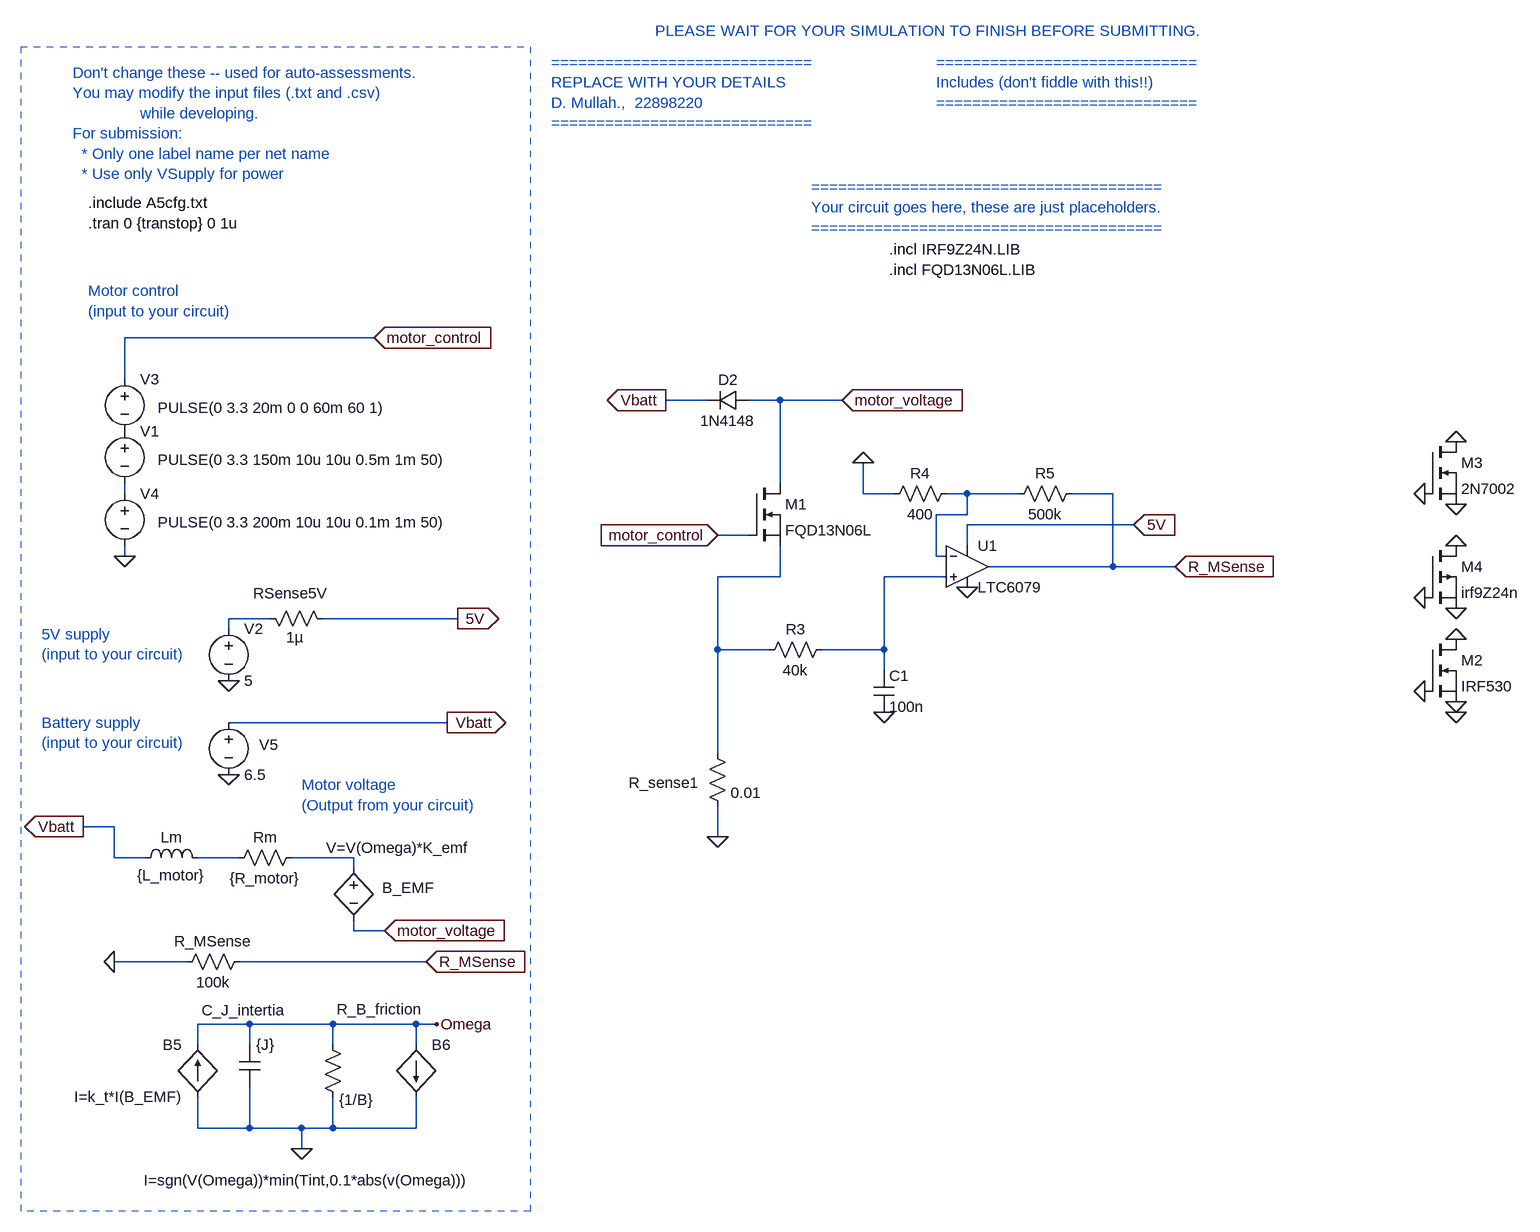
[diagram p0: schematic E344_22898220_A5.asc]
E344_22898220_A5.asc, the LTspice schematic file:
Version 4
SHEET 1 1824 2192
WIRE -1824 -976 -2208 -976
WIRE -2208 -912 -2208 -976
WIRE -1312 -880 -1376 -880
WIRE -1200 -880 -1248 -880
WIRE -1104 -880 -1200 -880
WIRE -1200 -752 -1200 -880
WIRE -2208 -736 -2208 -752
WIRE -1072 -736 -1072 -784
WIRE -1024 -736 -1072 -736
WIRE -912 -736 -944 -736
WIRE -832 -736 -912 -736
WIRE -688 -736 -752 -736
WIRE -912 -704 -912 -736
WIRE -912 -704 -960 -704
WIRE -656 -688 -912 -688
WIRE -1248 -672 -1296 -672
WIRE -912 -656 -912 -688
WIRE -2208 -640 -2208 -656
WIRE -960 -640 -960 -704
WIRE -944 -640 -960 -640
WIRE -688 -624 -688 -736
WIRE -688 -624 -880 -624
WIRE -592 -624 -688 -624
WIRE -1200 -608 -1200 -656
WIRE -1200 -608 -1296 -608
WIRE -944 -608 -1040 -608
WIRE -1984 -544 -2048 -544
WIRE -1696 -544 -1904 -544
WIRE -2048 -528 -2048 -544
WIRE -1296 -496 -1296 -608
WIRE -1216 -496 -1296 -496
WIRE -1040 -496 -1040 -608
WIRE -1040 -496 -1136 -496
WIRE -1040 -464 -1040 -496
WIRE -1712 -384 -2048 -384
WIRE -1296 -336 -1296 -496
WIRE -2224 -224 -2272 -224
WIRE -1296 -208 -1296 -256
WIRE -2224 -176 -2224 -224
WIRE -2176 -176 -2224 -176
WIRE -2032 -176 -2096 -176
WIRE -1856 -176 -1952 -176
WIRE -1856 -160 -1856 -176
WIRE -1856 -64 -1856 -80
WIRE -1808 -64 -1856 -64
WIRE -2112 -16 -2224 -16
WIRE -1744 -16 -2032 -16
WIRE -2016 80 -2096 80
WIRE -1888 80 -2016 80
WIRE -1760 80 -1888 80
WIRE -1728 80 -1760 80
WIRE -2096 112 -2096 80
WIRE -2016 112 -2016 80
WIRE -1888 112 -1888 80
WIRE -1760 112 -1760 80
WIRE -2096 240 -2096 192
WIRE -2016 240 -2016 176
WIRE -2016 240 -2096 240
WIRE -1936 240 -2016 240
WIRE -1888 240 -1888 192
WIRE -1888 240 -1936 240
WIRE -1760 240 -1760 192
WIRE -1760 240 -1888 240
WIRE -1936 272 -1936 240
FLAG -1696 -544 5V
IOPIN -1696 -544 Out
FLAG -2048 -448 0
FLAG -2208 -640 0
FLAG -1824 -976 motor_control
IOPIN -1824 -976 In
FLAG -1296 -672 motor_control
IOPIN -1296 -672 In
FLAG -1104 -880 motor_voltage
IOPIN -1104 -880 In
FLAG -2048 -304 0
FLAG -1712 -384 Vbatt
IOPIN -1712 -384 Out
FLAG -1808 -64 motor_voltage
IOPIN -1808 -64 In
FLAG -2272 -224 Vbatt
IOPIN -2272 -224 Out
FLAG -1728 80 Omega
FLAG -1936 272 0
FLAG -1376 -880 Vbatt
IOPIN -1376 -880 Out
FLAG -1744 -16 R_MSense
IOPIN -1744 -16 In
FLAG -2224 -16 0
FLAG -592 -624 R_MSense
IOPIN -592 -624 In
FLAG -656 -688 5V
IOPIN -656 -688 In
FLAG -160 -400 0
FLAG -208 -432 0
FLAG -160 -512 0
FLAG -160 -416 0
FLAG -160 -720 0
FLAG -208 -736 0
FLAG -160 -816 0
FLAG -208 -576 0
FLAG -160 -560 0
FLAG -160 -656 0
FLAG -1296 -208 0
FLAG -1072 -784 0
FLAG -912 -592 0
FLAG -1040 -400 0
SYMBOL voltage -2048 -544 R0
WINDOW 123 0 0 Left 0
WINDOW 39 0 0 Left 0
SYMATTR InstName V2
SYMATTR Value 5
SYMBOL res -2000 -560 M90
WINDOW 0 -7 47 VBottom 2
WINDOW 3 29 54 VTop 2
SYMATTR InstName RSense5V
SYMATTR Value 1µ
SYMBOL diode -1248 -896 R90
WINDOW 0 0 32 VBottom 2
WINDOW 3 32 32 VTop 2
SYMATTR InstName D2
SYMATTR Value 1N4148
SYMBOL voltage -2208 -928 R0
WINDOW 123 0 0 Left 0
WINDOW 39 0 0 Left 0
WINDOW 3 51 60 Left 2
SYMATTR Value PULSE(0 3.3 20m 0 0 60m 60 1)
SYMATTR InstName V3
SYMBOL voltage -2048 -400 R0
WINDOW 123 0 0 Left 0
WINDOW 39 0 0 Left 0
WINDOW 0 47 50 Left 2
SYMATTR InstName V5
SYMATTR Value 6.5
SYMBOL res -2048 -160 R270
WINDOW 3 0 56 VBottom 2
WINDOW 0 32 56 VTop 2
SYMATTR Value {R_motor}
SYMATTR InstName Rm
SYMBOL ind -2192 -160 R270
WINDOW 0 32 56 VTop 2
WINDOW 3 5 56 VBottom 2
SYMATTR InstName Lm
SYMATTR Value {L_motor}
SYMBOL bv -1856 -176 R0
WINDOW 3 -42 -15 Left 2
WINDOW 0 44 46 Left 2
SYMATTR Value V=V(Omega)*K_emf
SYMATTR InstName B_EMF
SYMBOL bi -2096 192 R180
WINDOW 0 24 80 Left 2
WINDOW 3 24 0 Left 2
SYMATTR InstName B5
SYMATTR Value I=k_t*I(B_EMF)
SYMBOL bi -1760 112 R0
WINDOW 3 -419 208 Left 2
SYMATTR Value I=sgn(V(Omega))*min(Tint,0.1*abs(v(Omega)))
SYMATTR InstName B6
SYMBOL cap -2032 112 R0
WINDOW 0 -58 -53 Left 2
WINDOW 3 26 0 Left 2
SYMATTR InstName C_J_intertia
SYMATTR Value {J}
SYMBOL res -1904 96 R0
WINDOW 0 22 -39 Left 2
WINDOW 3 26 100 Left 2
SYMATTR InstName R_B_friction
SYMATTR Value {1/B}
SYMBOL voltage -2208 -848 R0
WINDOW 123 0 0 Left 0
WINDOW 39 0 0 Left 0
WINDOW 3 51 60 Left 2
SYMATTR Value PULSE(0 3.3 150m 10u 10u 0.5m 1m 50)
SYMATTR InstName V1
SYMBOL voltage -2208 -752 R0
WINDOW 123 0 0 Left 0
WINDOW 39 0 0 Left 0
WINDOW 3 51 60 Left 2
SYMATTR Value PULSE(0 3.3 200m 10u 10u 0.1m 1m 50)
SYMATTR InstName V4
SYMBOL res -2016 -32 R90
WINDOW 0 0 56 VBottom 2
WINDOW 3 32 56 VTop 2
SYMATTR InstName R_MSense
SYMATTR Value 100k
SYMBOL Opamps\\LTC6079 -912 -624 R0
SYMATTR InstName U1
SYMBOL nmos -208 -512 R0
SYMATTR InstName M2
SYMATTR Value IRF530
SYMBOL nmos -208 -816 R0
SYMATTR InstName M3
SYMATTR Value 2N7002
SYMBOL pmos -208 -656 R0
SYMATTR InstName M4
SYMATTR Value irf9Z24n
SYMBOL nmos -1248 -752 R0
SYMATTR InstName M1
SYMATTR Value FQD13N06L
SYMBOL res -1120 -512 R90
WINDOW 0 0 56 VBottom 2
WINDOW 3 32 56 VTop 2
SYMATTR InstName R3
SYMATTR Value 40k
SYMBOL res -1312 -352 R0
WINDOW 0 -121 61 Left 2
SYMATTR InstName R_sense1
SYMATTR Value 0.01
SYMBOL res -928 -752 R90
WINDOW 0 0 56 VBottom 2
WINDOW 3 32 56 VTop 2
SYMATTR InstName R4
SYMATTR Value 400
SYMBOL res -736 -752 R90
WINDOW 0 0 56 VBottom 2
WINDOW 3 32 56 VTop 2
SYMATTR InstName R5
SYMATTR Value 500k
SYMBOL cap -1056 -464 R0
SYMATTR InstName C1
SYMATTR Value 100n
TEXT -2288 -1384 Left 2 ;Don't change these -- used for auto-assessments.\nYou may modify the input files (.txt and .csv) \n               while developing.\nFor submission: \n  * Only one label name per net name\n  * Use only VSupply for power
TEXT -1552 -1400 Left 2 ;=============================\nREPLACE WITH YOUR DETAILS\nD. Mullah.,  22898220\n=============================
TEXT -960 -1400 Left 2 ;=============================\nIncludes (don't fiddle with this!!)\n=============================
TEXT -1152 -1208 Left 2 ;=======================================\nYour circuit goes here, these are just placeholders.\n=======================================
TEXT -1392 -1448 Left 2 ;PLEASE WAIT FOR YOUR SIMULATION TO FINISH BEFORE SUBMITTING.
TEXT -2264 -1152 Left 2 !.tran 0 {transtop} 0 1u
TEXT -2264 -1184 Left 2 !.include A5cfg.txt
TEXT -2264 -1048 Left 2 ;Motor control\n(input to your circuit)
TEXT -2336 -520 Left 2 ;5V supply \n(input to your circuit)
TEXT -2336 -384 Left 2 ;Battery supply \n(input to your circuit)
TEXT -1936 -288 Left 2 ;Motor voltage\n(Output from your circuit)
TEXT -1032 -1112 Left 2 !.incl IRF9Z24N.LIB\n.incl FQD13N06L.LIB
LINE Normal -1584 -1424 -1584 368 2
LINE Normal -2368 -1424 -1584 -1424 2
LINE Normal -1584 368 -2368 368 2
LINE Normal -2368 -1424 -2368 368 2

The netlist it stands for:
* E344_22898220_A5.asc
V2 N005 0 5
RSense5V N005 5V 1µ
D2 motor_voltage Vbatt 1N4148
V3 motor_control P001 PULSE(0 3.3 20m 0 0 60m 60 1)
V5 Vbatt 0 6.5
Rm N006 N007 {R_motor}
Lm Vbatt N006 {L_motor}
B_EMF N007 motor_voltage V=V(Omega)*K_emf
B5 0 Omega I=k_t*I(B_EMF)
B6 Omega 0 I=sgn(V(Omega))*min(Tint,0.1*abs(v(Omega)))
C_J_intertia Omega 0 {J}
R_B_friction Omega 0 {1/B}
V1 P001 N001 PULSE(0 3.3 150m 10u 10u 0.5m 1m 50)
V4 N001 0 PULSE(0 3.3 200m 10u 10u 0.1m 1m 50)
R_MSense R_MSense 0 100k
XU1 N004 N002 5V 0 R_MSense LTC6078  ; LTC6079, pins In+ In- V+ V- OUT
M2 0 0 0 0 IRF530
M3 0 0 0 0 2N7002
M4 0 0 0 0 irf9Z24n
M1 motor_voltage motor_control N003 N003 FQD13N06L
R3 N004 N003 40k
R_sense1 N003 0 0.01
R4 N002 0 400
R5 R_MSense N002 500k
C1 N004 0 100n
.model D D
.lib standard.dio
.model NMOS NMOS
.model PMOS PMOS
.lib standard.mos
* Don't change these -- used for auto-assessments.
* You may modify the input files (.txt and .csv)
*                while developing.
* For submission:
*   * Only one label name per net name
*   * Use only VSupply for power
* =============================
* REPLACE WITH YOUR DETAILS
* D. Mullah.,  22898220
* =============================
* =============================
* Includes (don't fiddle with this!!)
* =============================
* =======================================
* Your circuit goes here, these are just placeholders.
* =======================================
* PLEASE WAIT FOR YOUR SIMULATION TO FINISH BEFORE SUBMITTING.
.tran 0 {transtop} 0 1u
.include A5cfg.txt
* Motor control
* (input to your circuit)
* 5V supply
* (input to your circuit)
* Battery supply
* (input to your circuit)
* Motor voltage
* (Output from your circuit)
.incl IRF9Z24N.LIB
.incl FQD13N06L.LIB
.lib LTC5.lib
.backanno
.end